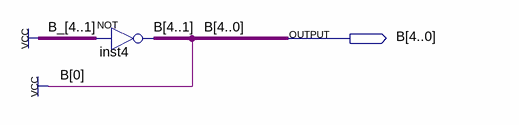
[diagram p0: schematic sheet]
// Quartus schematic CONST1.bdf as structural Verilog: 1 symbols, 1 pins
module CONST1 (
  output [4:0] B
);

  assign B[4:1] = ~4'b1111;  // NOT inst4, 4 bits wide

  assign B[0] = 1'b1;
endmodule
